# EAGLE design full_hand_circuit_esp_v7_1_no_butt (EAGLE 9.2.0)
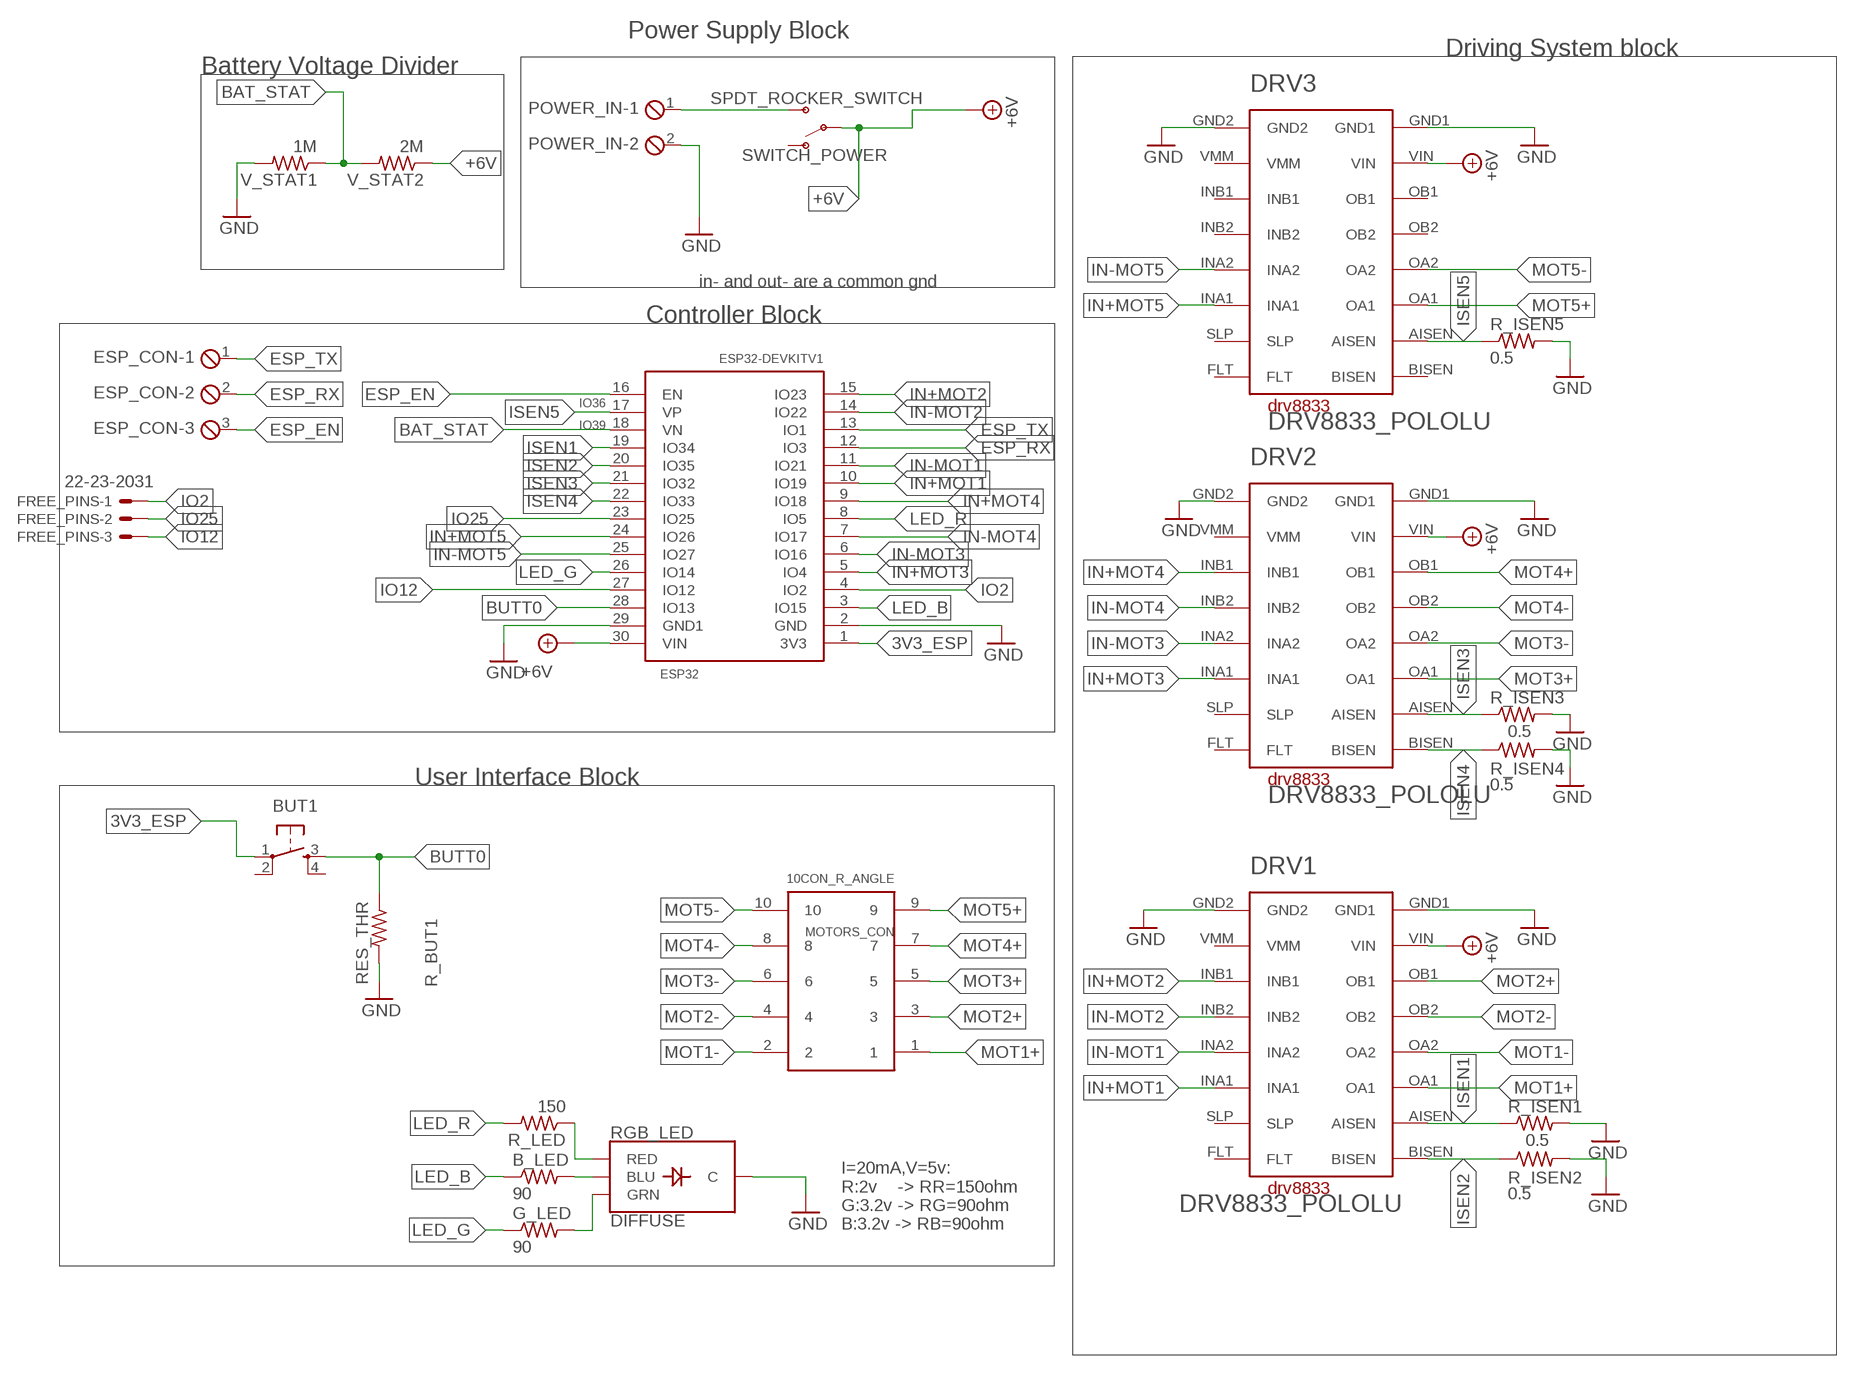
[diagram p0: schematic, sheet 1]

## Parts
B_LED  90  RES_THR  [R_THR]
BUT1  PUSH_BUTTON  [B3F-40XX]
DRV1  DRV8833_POLOLU  [DRV8833_POLOLU]
DRV2  DRV8833_POLOLU  [DRV8833_POLOLU]
DRV3  DRV8833_POLOLU  [DRV8833_POLOLU]
ESP32  ESP32DEVKITV1  [ESP32-DEVKITV1]
ESP_CON  MPT3  [3POL254]
FREE_PINS  22-23-2031  [22-23-2031]
G_LED  90  RES_THR  [R_THR]
MOTORS_CON  10CON_R_ANGLE  [CON10_R_ANGLE]
POWER_IN  MPT2  [2POL254]
R_BUT1  RES_THR  [R_THR]
R_ISEN1  0.5  RES_THR  [R_THR]
R_ISEN2  0.5  RES_THR  [R_THR]
R_ISEN3  0.5  RES_THR  [R_THR]
R_ISEN4  0.5  RES_THR  [R_THR]
R_ISEN5  0.5  RES_THR  [R_THR]
R_LED  150  RES_THR  [R_THR]
RGB_LED  DIFFUSE  LED_RGB_CC  [LED-RGB-THRU]
SWITCH_POWER  SPDT_ROCKER_SWITCH  [SWITCH_SPDT_PTH_11.6X4.0MM]
V_STAT1  1M  RES_THR  [R_THR]
V_STAT2  2M  RES_THR  [R_THR]

## Nets
3V3_ESP: BUT1.1(P) ESP32.1(3V3)
+6V [power]: DRV1.VIN DRV2.VIN DRV3.VIN ESP32.30(VIN) SWITCH_POWER.2(P) V_STAT2.1
BAT_STAT: ESP32.18(VN) V_STAT1.1 V_STAT2.2
BLUE: B_LED.2 RGB_LED.4(BLU)
BUTT0: BUT1.3(S) ESP32.28(IO13) R_BUT1.1
ESP_EN: ESP32.16(EN) ESP_CON.3
ESP_RX: ESP32.12(IO3) ESP_CON.2
ESP_TX: ESP32.13(IO1) ESP_CON.1
GND [power]: DRV1.GND1 DRV1.GND2 DRV2.GND1 DRV2.GND2 DRV3.GND1 DRV3.GND2 ESP32.2(GND) ESP32.29(GND1) POWER_IN.2 R_BUT1.2 R_ISEN1.2 R_ISEN2.2 R_ISEN3.2 R_ISEN4.2 R_ISEN5.2 RGB_LED.2(C) V_STAT1.2
GREEN: G_LED.2 RGB_LED.3(GRN)
IN+MOT1: DRV1.INA1 ESP32.10(IO19)
IN+MOT2: DRV1.INB1 ESP32.15(IO23)
IN+MOT3: DRV2.INA1 ESP32.5(IO4)
IN+MOT4: DRV2.INB1 ESP32.9(IO18)
IN+MOT5: DRV3.INA1 ESP32.24(IO26)
IN-MOT1: DRV1.INA2 ESP32.11(IO21)
IN-MOT2: DRV1.INB2 ESP32.14(IO22)
IN-MOT3: DRV2.INA2 ESP32.6(IO16)
IN-MOT4: DRV2.INB2 ESP32.7(IO17)
IN-MOT5: DRV3.INA2 ESP32.25(IO27)
IN_HIGH [power]: POWER_IN.1 SWITCH_POWER.3(S)
IO2: ESP32.4(IO2) FREE_PINS.1
IO12: ESP32.27(IO12) FREE_PINS.3
IO25: ESP32.23(IO25) FREE_PINS.2
ISEN1 [signal_measu]: DRV1.AISEN ESP32.19(IO34) R_ISEN1.1
ISEN2 [signal_measu]: DRV1.BISEN ESP32.20(IO35) R_ISEN2.1
ISEN3 [signal_measu]: DRV2.AISEN ESP32.21(IO32) R_ISEN3.1
ISEN4 [signal_measu]: DRV2.BISEN ESP32.22(IO33) R_ISEN4.1
ISEN5 [signal_measu]: DRV3.AISEN ESP32.17(VP) R_ISEN5.1
LED_B: B_LED.1 ESP32.3(IO15)
LED_G: ESP32.26(IO14) G_LED.1
LED_R: ESP32.8(IO5) R_LED.2
MOT1+ [motor]: DRV1.OA1 MOTORS_CON.1
MOT1- [motor]: DRV1.OA2 MOTORS_CON.2
MOT2+ [motor]: DRV1.OB1 MOTORS_CON.3
MOT2- [motor]: DRV1.OB2 MOTORS_CON.4
MOT3+ [motor]: DRV2.OA1 MOTORS_CON.5
MOT3- [motor]: DRV2.OA2 MOTORS_CON.6
MOT4+: DRV2.OB1 MOTORS_CON.7
MOT4- [motor]: DRV2.OB2 MOTORS_CON.8
MOT5+ [motor]: DRV3.OA1 MOTORS_CON.9
MOT5- [motor]: DRV3.OA2 MOTORS_CON.10
RED: R_LED.1 RGB_LED.1(RED)
Unconnected: BUT1.2(P1) BUT1.4(S1) DRV1.FLT DRV1.SLP DRV1.VMM DRV2.FLT DRV2.SLP DRV2.VMM DRV3.BISEN DRV3.FLT DRV3.INB1 DRV3.INB2 DRV3.OB1 DRV3.OB2 DRV3.SLP DRV3.VMM SWITCH_POWER.1(O)

## Notes on the sheet
- Power Supply Block
- Driving System block
- Battery Voltage Divider
- in- and out- are a common gnd
- Controller Block
- IO36
- IO39
- User Interface Block
- I=20mA,V=5v:
  R:2v    -> RR=150ohm
  G:3.2v -> RG=90ohm
  B:3.2v -> RB=90ohm

## Library data of the parts
B_LED G_LED R_BUT1 R_ISEN1-R_ISEN5 R_LED V_STAT1 V_STAT2 = Oded_Hand:RES_THR
BUT1 = Oded_Hand:PUSH_BUTTON
DRV1-DRV3 = Oded_Hand:DRV8833_POLOLU
ESP32 = Oded_Hand:ESP32DEVKITV1
ESP_CON = Oded_Hand:MPT3: PHOENIX CONNECTOR; OC_FARNELL: unknown; OC_NEWARK: unknown
FREE_PINS = Oded_Hand:22-23-2031: .100" (2.54mm) Center Header - 3 Pin; MF: MOLEX; MPN: 22-23-2031; OC_FARNELL: 1462950; OC_NEWARK: 30C0862
MOTORS_CON = Oded_Hand:10CON_R_ANGLE
POWER_IN = Oded_Hand:MPT2: PHOENIX CONNECTOR; OC_FARNELL: unknown; OC_NEWARK: unknown
RGB_LED = Oded_Hand:LED_RGB_CC
SWITCH_POWER = Oded_Hand:SPDT_ROCKER_SWITCH

## Net classes
1 power: width 0.762 mm, clearance 0.254 mm
2 signal_measu: clearance 0.508 mm
3 motor: width 0.508 mm, clearance 0.254 mm

## Board
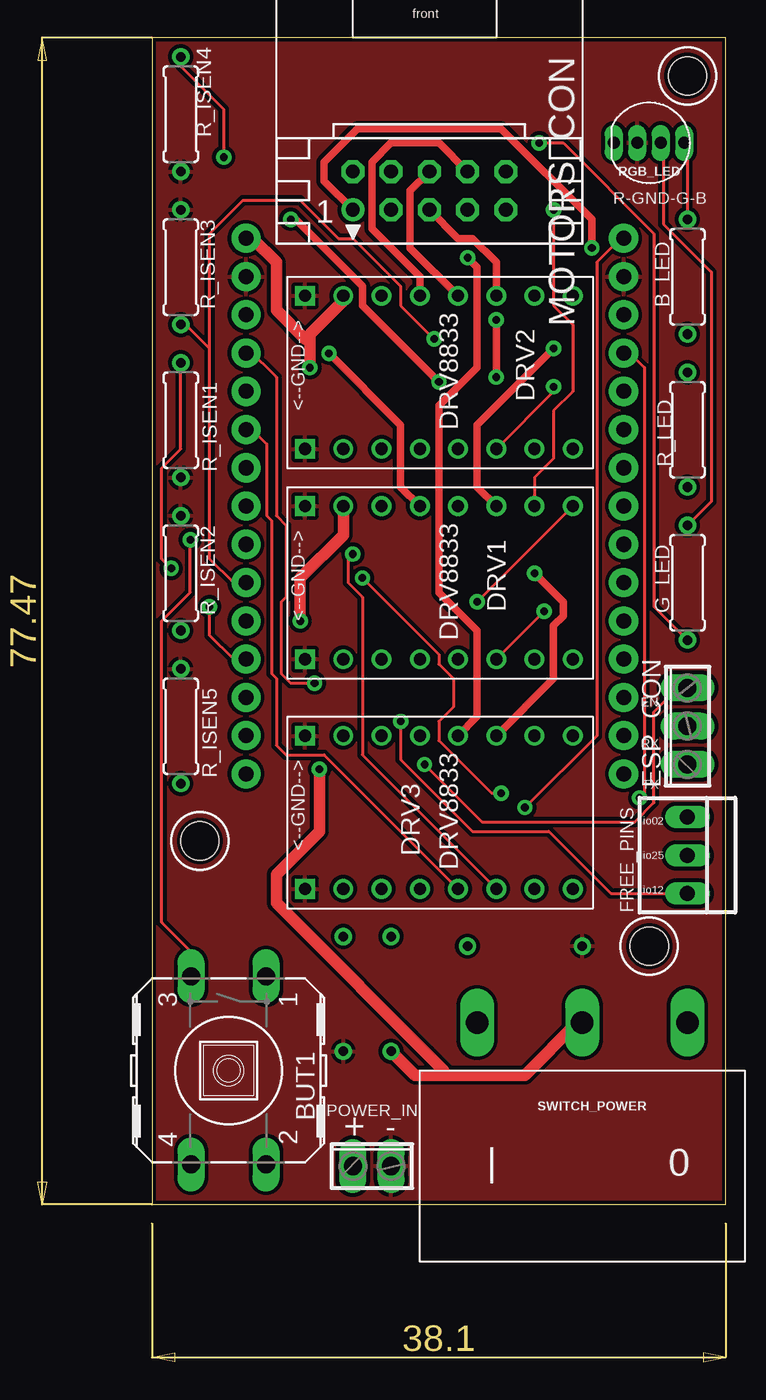
[diagram p1: board, top side]
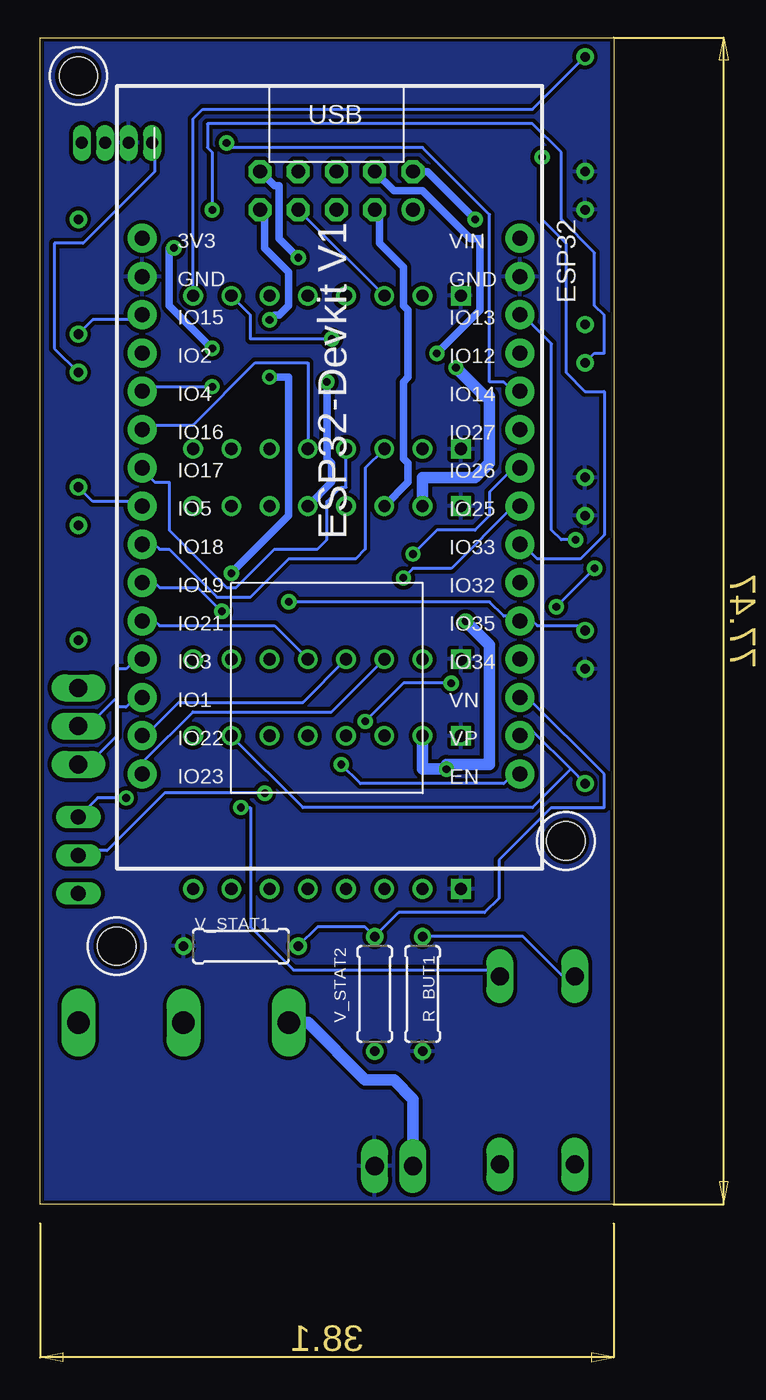
[diagram p2: board, bottom side, seen from below]

Size 38.1 x 77.47 mm. Coordinates in mm from the lower left corner, seen from the top.
Outline: 0,0 38.1,0 38.1,77.47 0,77.47 0,0
Copper layers (1*16): Top 0.035mm / dielectric 1.5mm / Bottom 0.035mm
Design rules "SparkFun *": minimum track width 8mil, minimum drill 20mil, track to track 8mil, track to pad 8mil, pad to pad 8mil, via to via 8mil, smd to smd 8mil, copper to edge 10mil, drill to drill 8mil, minimum pad ring 5mil, minimum via ring 10mil, stop-mask expansion 4mil, vias tented up to drill 25mil, thermal gap 10mil
Holes 2.54 mm at 35.56,74.93 33.02,17.14 3.17,24.13

### Footprints (pad centres in the part's own frame; a part is rotated, then mirrored left to right if it is on the bottom)
R_THR = drill 0.635 pad 1.143: 1 -3.81,0; 2 3.81,0
B3F-40XX = drill 1.194 pad 1.778 long: 1 -6.248,2.489; 2 6.248,2.489; 3 -6.248,-2.489; 4 6.248,-2.489
DRV8833_POLOLU = drill 0.8 pad 1.321: AISEN 6.35,-7.62; BISEN 6.35,-10.16; FLT -3.81,-10.16; INA1 -3.81,-5.08; INA2 -3.81,-2.54; INB1 -3.81,2.54; INB2 -3.81,0; OA1 6.35,-5.08; OA2 6.35,-2.54; OB1 6.35,2.54; OB2 6.35,0; SLP -3.81,-7.62; VIN 6.35,5.08; VMM -3.81,5.08 | drill 0.8 pad 1.321 square: GND1 6.35,7.62; GND2 -3.81,7.62
ESP32-DEVKITV1 = drill 1 pad 1.93: 1 -22.87,-13.54; 2 -20.33,-13.54; 3 -17.79,-13.54; 4 -15.25,-13.54; 5 -12.71,-13.54; 6 -10.17,-13.54; 7 -7.63,-13.54; 8 -5.09,-13.54; 9 -2.55,-13.54; 10 -0.01,-13.54; 11 2.53,-13.54; 12 5.07,-13.54; 13 7.61,-13.54; 14 10.15,-13.54; 15 12.69,-13.54; 16 12.69,11.547; 17 10.15,11.547; 18 7.61,11.547; 19 5.07,11.547; 20 2.53,11.547; 21 -0.01,11.547; 22 -2.55,11.547; 23 -5.09,11.547; 24 -7.63,11.547; 25 -10.17,11.547; 26 -12.71,11.547; 27 -15.25,11.547; 28 -17.79,11.547; 29 -20.33,11.547; 30 -22.87,11.547
3POL254 = drill 1.2 pad 1.803 long: 1 -2.54,0; 2 0,0; 3 2.54,0
22-23-2031 = drill 1 pad 1.499 long: 1 -2.54,0; 2 0,0; 3 2.54,0
CON10_R_ANGLE = drill 0.914 pad 1.524: 1 5.08,1.27 | drill 0.914 pad 1.524 octagon: 2 5.08,-1.27; 3 2.54,1.27; 4 2.54,-1.27; 5 0,1.27; 6 0,-1.27; 7 -2.54,1.27; 8 -2.54,-1.27; 9 -5.08,1.27; 10 -5.08,-1.27
2POL254 = drill 1.2 pad 1.803 long: 1 -1.27,0; 2 1.27,0
LED-RGB-THRU = drill 0.8 pad 1.016 long: 1 2.349,0; 2 0.794,0; 3 -0.762,0; 4 -2.318,0
SWITCH_SPDT_PTH_11.6X4.0MM = drill 1.499 pad 2.235 long: 1 0,6.985; 2 0,0; 3 0,-6.985

### Placement (x,y rotation side)
B_LED  35.56,61.59 90 top
BUT1  5.08,8.89 270 top
DRV1  17.78,40.01 90 top
DRV2  17.78,53.98 90 top
DRV3  17.78,24.77 90 top
ESP32  17.78,41.27 270 bottom
ESP_CON  35.56,31.75 90 top
FREE_PINS  35.56,23.18 270 top
G_LED  35.56,41.27 90 top
MOTORS_CON  18.41,67.31 180 top
POWER_IN  14.61,2.54 0 top
R_BUT1  12.7,13.97 270 bottom
R_ISEN1  1.91,52.07 270 top
R_ISEN2  1.91,41.91 90 top
R_ISEN3  1.91,62.23 90 top
R_ISEN4  1.91,72.39 270 top
R_ISEN5  1.91,31.75 90 top
R_LED  35.56,51.44 270 top
RGB_LED  33.02,70.48 180 top
SWITCH_POWER  28.57,12.06 270 top
V_STAT1  24.77,17.14 180 bottom
V_STAT2  15.88,13.97 90 bottom

### Tracks (layer width: path | path; a pad name or v marks a point on that pad's centre or on a via)
3V3_ESP  (via drill 0.51)
  Top 0.203: v24.77,26.35 29.53,31.11 29.53,62.55 31.11,64.14 ESP32.1
  Bottom 0.203: v24.77,26.35 24.13,26.35 24.13,18.41 21.27,15.56 7.94,15.56 7.62,15.24 BUT1.1
+6V  (via drill 0.51)
  Top 0.762: 10.48,57.47 10.48,57.78 12.7,60.01 DRV2.VIN | 10.48,57.47 v10.48,55.56 | ESP32.30 6.35,64.14 6.67,64.14 8.26,62.55 8.26,59.37 10.16,57.47 10.48,57.47 | V_STAT2.1 17.46,8.57 19.37,8.57 | 19.37,8.57 24.77,8.57 28.26,12.06 SWITCH_POWER.2 | v11.11,28.89 11.11,24.77 8.26,21.91 8.26,20 19.37,8.89 19.37,8.57 | DRV1.VIN 12.7,44.45 9.84,41.59 v9.84,38.73
  Bottom 0.762: DRV1.VIN 12.7,48.26 9.21,48.26 8.26,49.21 8.26,53.66 8.57,53.66 v10.48,55.56 | DRV3.VIN 12.7,28.89 v11.11,28.89 11.11,29.21 8.26,29.21 8.26,37.15 v9.84,38.73
BAT_STAT
  Bottom 0.203: V_STAT1.1 19.68,18.41 16.51,18.41 V_STAT2.2 14.29,19.37 8.57,19.37 7.62,20.32 7.62,22.86 4.13,26.35 0.64,26.35 0.64,28.57 5.72,33.66 ESP32.18
BLUE
  Top 0.203: B_LED.2 35.56,70.48 RGB_LED.4
BUTT0  (via drill 0.51)
  Top 0.203: v2.54,44.13 2.54,40.64 0.64,38.73 0.64,18.73 2.54,16.83 2.54,15.24 BUT1.3
  Bottom 0.203: R_BUT1.1 6.03,17.78 3.49,15.24 2.86,15.24 BUT1.3 | v2.54,44.13 3.49,44.13 4.13,44.77 4.13,57.15 6.03,59.05 ESP32.28
ESP_EN  (via drill 0.51)
  Top 0.203: ESP_CON.3 34.92,34.29 33.34,32.7 33.34,26.67 32.07,25.4 21.91,25.4 v18.1,29.21
  Bottom 0.203: v18.1,29.21 16.83,27.94 7.3,27.94 6.67,28.57 6.35,28.57 ESP32.16
ESP_RX
  Bottom 0.203: ESP_CON.2 34.92,32.38 34.29,32.38 33.02,33.66 33.02,35.56 32.38,35.56 31.75,36.2 31.43,36.2 ESP32.12
ESP_TX
  Bottom 0.203: ESP_CON.1 34.92,29.84 34.29,29.84 33.02,31.11 33.02,33.02 32.38,33.02 31.75,33.66 31.43,33.66 ESP32.13
GND
  pour Top: -0.95,-2.54 38.73,-2.54 38.73,78.11 -0.95,78.11
  pour Bottom: -1.27,-3.81 40.01,-3.81 40.01,78.74 -1.91,78.74 -1.91,-3.17
GREEN
  Top 0.203: G_LED.2 37.15,46.67 37.15,61.91 33.97,65.09 33.97,70.48 RGB_LED.3
IN+MOT1  (via drill 0.51)
  Top 0.203: v26.04,39.37 DRV1.INA1
  Bottom 0.203: v26.04,39.37 27.62,40.96 30.16,40.96 30.48,41.27 31.11,41.27 ESP32.10
IN+MOT2
  Bottom 0.203: DRV1.INB1 18.73,32.7 27.94,32.7 31.11,29.53 31.11,28.89 ESP32.15
IN+MOT3  (via drill 0.51)
  Top 0.203: DRV2.INA1 26.67,53.98 v26.67,54.29
  Bottom 0.203: v26.67,54.29 31.11,54.29 ESP32.5
IN+MOT4
  Bottom 0.203: DRV2.INB1 16.51,48.9 16.51,43.5 17.14,42.86 21.59,42.86 24.13,40.32 26.35,40.32 29.53,43.5 30.16,43.5 30.48,43.81 31.11,43.81 ESP32.9
IN+MOT5  (via drill 0.51)
  Top 0.203: DRV3.INA1 13.97,29.84 13.97,40.32 13.02,41.27 13.02,42.86 v13.34,43.18
  Bottom 0.203: v13.34,43.18 11.75,44.77 9.21,44.77 8.26,45.72 8.26,47.31 6.67,48.9 6.35,48.9 ESP32.24
IN-MOT1
  Bottom 0.203: DRV1.INA2 22.54,38.42 30.16,38.42 30.48,38.73 31.11,38.73 ESP32.11
IN-MOT2
  Bottom 0.203: DRV1.INB2 20.64,33.34 28.89,33.34 30.8,31.43 31.11,31.43 ESP32.14
IN-MOT3
  Bottom 0.203: DRV2.INA2 20.32,55.88 23.81,55.88 27.94,51.75 31.11,51.75 ESP32.6
IN-MOT4
  Bottom 0.203: DRV2.INB2 17.78,47.62 18.1,47.62 19.05,46.67 19.05,44.13 19.68,43.5 22.54,43.5 25.08,40.96 25.72,40.96 29.53,44.77 29.53,47.94 30.48,47.94 31.43,48.9 ESP32.7
IN-MOT5
  Top 0.203: DRV3.INA2 11.43,29.84 8.89,29.84 8.26,30.48 8.26,34.92 7.94,35.24 7.94,45.4 7.62,45.72 7.62,50.48 6.35,51.75 ESP32.25
IN_HIGH
  Bottom 0.762: SWITCH_POWER.3 20.32,12.06 16.51,8.26 14.61,8.26 13.34,6.99 POWER_IN.1
IO2  (via drill 0.51)
  Top 0.203: v32.38,26.99 32.7,27.3 32.7,55.56 31.43,56.83 ESP32.4
  Bottom 0.203: FREE_PINS.1 34.29,26.99 v32.38,26.99
IO12  (via drill 0.51)
  Top 0.203: FREE_PINS.3 30.48,20.64 26.35,24.77 21.27,24.77 16.51,29.53 v16.51,32.07 | v10.79,34.61 9.21,34.61 8.57,35.24 8.57,40.01 8.89,40.32 8.89,45.09 8.26,45.72 8.26,54.93 6.35,56.83 ESP32.27
  Bottom 0.203: v16.51,32.07 13.97,34.61 v10.79,34.61
IO25  (via drill 0.51)
  Top 0.203: v23.18,27.3 22.54,27.3 19.05,30.8 19.05,32.07 20,33.02 20,34.92 19.05,35.88 19.05,36.51 v13.97,41.59
  Bottom 0.203: FREE_PINS.2 35.24,23.5 33.66,23.5 29.84,27.3 v23.18,27.3 | v13.97,41.59 13.34,42.23 10.79,42.23 6.67,46.35 6.35,46.35 ESP32.23
ISEN1  (via drill 0.51)
  Top 0.203: R_ISEN1.1 1.91,50.16 0.64,48.9 0.64,42.86 v1.27,42.23 | v3.81,39.69 3.81,37.78 5.4,36.2 6.03,36.2 ESP32.19 | DRV1.AISEN 25.4,48.26 26.67,49.53 26.67,52.7 27.94,53.98 27.94,58.42 26.67,59.69 v26.67,66.04
  Bottom 0.203: v3.81,39.69 v1.27,42.23 | v26.67,66.04 26.67,69.85 26.99,70.17 26.99,71.75 5.4,71.75 3.49,69.85 3.49,65.41 1.27,63.18 1.27,59.69 0.64,59.05 0.64,56.52 1.27,56.52 R_ISEN1.1
ISEN2  (via drill 0.51)
  Top 0.203: v21.59,40.01 DRV1.BISEN
  Bottom 0.203: R_ISEN2.1 2.22,38.42 5.08,38.42 5.4,38.73 6.03,38.73 ESP32.20 6.35,39.05 7.3,39.05 8.26,40.01 v21.59,40.01
ISEN3  (via drill 0.51)
  Top 0.203: R_ISEN3.1 2.22,58.42 3.81,56.83 | 3.81,56.83 3.81,42.86 5.4,41.27 6.03,41.27 ESP32.21 | v18.73,57.47 16.51,59.69 16.51,60.96 13.34,64.14 12.38,64.14 9.84,66.67 6.03,66.67 3.81,64.45 3.81,56.83
  Bottom 0.203: DRV2.AISEN 24.13,59.05 24.13,57.47 v18.73,57.47
ISEN4  (via drill 0.51)
  Top 0.203: v4.76,69.53 4.76,72.71 1.91,75.56 R_ISEN4.1
  Bottom 0.203: R_ISEN4.1 5.4,72.71 27.3,72.71 27.94,72.07 DRV2.BISEN | v4.76,69.53 4.76,65.41 3.17,63.82 3.17,55.24 1.91,53.98 0.64,53.98 0.64,44.45 2.22,42.86 5.08,42.86 6.03,43.81 ESP32.22
ISEN5
  Bottom 0.203: 2.86,28.89 5.4,31.43 6.03,31.43 ESP32.17 | 2.86,28.89 R_ISEN5.1 | DRV3.AISEN 20.64,26.35 5.4,26.35 2.86,28.89
LED_B
  Bottom 0.203: B_LED.1 34.61,58.74 31.75,58.74 31.43,59.05 ESP32.3
LED_G  (via drill 0.51)
  Top 0.203: G_LED.1 33.34,39.69 33.34,64.45 27.3,70.48 v25.72,70.48
  Bottom 0.203: v25.72,70.48 25.4,70.17 12.7,70.17 8.26,65.72 8.26,54.61 7.3,54.61 6.99,54.29 6.35,54.29 ESP32.26
LED_R
  Bottom 0.203: R_LED.2 34.61,46.67 31.43,46.67 ESP32.8
MOT1+  (via drill 0.51)
  Top 0.508: DRV1.OA1 21.59,47.62 21.59,51.75 v26.67,56.83 | v29.21,63.5 29.21,65.41 23.18,71.44 13.65,71.44 11.43,69.22 11.43,67.94 MOTORS_CON.1
  Bottom 0.508: v26.67,56.83 29.53,59.69 29.53,63.5 v29.21,63.5
MOT1-  (via drill 0.51)
  Top 0.508: v19.05,54.61 13.97,59.69 13.97,60.96 9.53,65.41 v9.21,65.41
  Bottom 0.508: DRV1.OA2 18.73,47.94 18.73,49.21 19.05,49.53 v19.05,54.61 | v9.21,65.41 12.38,68.58 MOTORS_CON.2
MOT2+
  Bottom 0.508: DRV1.OB1 13.65,47.94 13.65,49.21 13.97,49.53 13.97,54.61 13.65,54.93 13.65,59.37 13.97,59.69 13.97,62.23 15.56,63.82 15.56,66.04 MOTORS_CON.3
MOT2-  (via drill 0.51)
  Top 0.508: DRV1.OB2 16.51,47.62 16.51,51.75 v11.75,56.52
  Bottom 0.508: v11.75,56.52 8.89,59.37 8.89,64.14 9.53,64.14 12.7,67.31 14.61,67.31 MOTORS_CON.4
MOT3+
  Top 0.508: DRV2.OA1 22.86,62.55 21.27,64.14 20.32,64.14 MOTORS_CON.5
MOT3-
  Top 0.508: DRV2.OA2 17.14,63.5 17.14,67.31 MOTORS_CON.6
MOT4+
  Bottom 0.203: MOTORS_CON.7 DRV2.OB1
MOT4-
  Top 0.508: DRV2.OB2 17.78,61.59 14.61,64.77 14.61,69.22 15.88,70.48 19.05,70.48 MOTORS_CON.8
MOT5+  (via drill 0.51)
  Top 0.508: DRV3.OA1 26.67,34.92 26.67,38.42 27.3,39.05 27.3,40.01 v25.4,41.91 | v22.86,58.74 v22.86,54.93
  Bottom 0.508: v25.4,41.91 21.59,45.72 21.59,54.93 v22.86,54.93 | v22.86,58.74 22.54,59.05 22.23,59.05 21.59,59.69 21.59,61.91 23.18,63.5 23.18,66.04 MOTORS_CON.9
MOT5-  (via drill 0.51)
  Top 0.508: DRV3.OA2 21.59,32.38 21.59,38.1 19.05,40.64 19.05,44.13 | 19.05,44.13 19.05,53.02 21.59,55.56 21.59,62.23 v20.95,62.87 | 19.05,44.13
  Bottom 0.508: v20.95,62.87 22.23,64.14 22.23,67.63 22.54,67.63 MOTORS_CON.10
RED
  Bottom 0.203: R_LED.1 37.15,56.83 37.15,63.82 35.24,63.82 30.48,68.58 30.48,70.48 RGB_LED.1

### Text on the board
tPlace: R-GND-G-B | EN / / / RX / / / TX | io02 / / / io25 / / / io12 | + | -